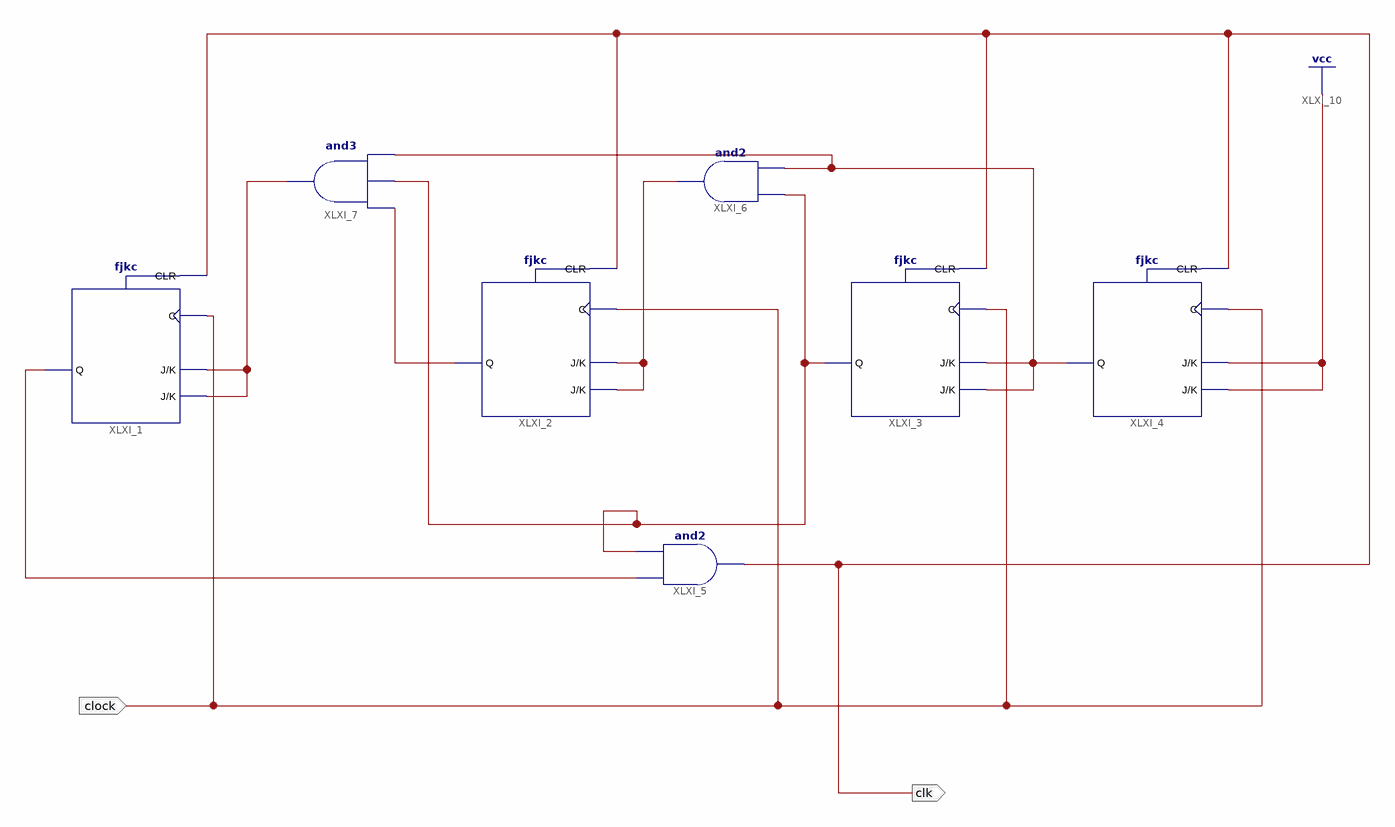
[diagram p0: schematic sheet 1]
// Xilinx ISE schematic mod10.sch (spartan6) as structural Verilog: 7 symbols, 2 ports
module mod10 (
  input  clock,
  output clk
);

  wire XLXN_4, XLXN_5, XLXN_6, XLXN_7, XLXN_9, XLXN_10;

  fjkc XLXI_1 (.C(clock), .CLR(clk), .J(XLXN_9), .K(XLXN_9), .Q(XLXN_10));
  fjkc XLXI_2 (.C(clock), .CLR(clk), .J(XLXN_6), .K(XLXN_6), .Q(XLXN_7));
  and XLXI_5 (clk, XLXN_10, XLXN_5);
  and XLXI_6 (XLXN_6, XLXN_4, XLXN_5);
  and XLXI_7 (XLXN_9, XLXN_7, XLXN_5, XLXN_4);
  fjkc XLXI_4 (.C(clock), .CLR(clk), .J(1'b1), .K(1'b1), .Q(XLXN_4));
  fjkc XLXI_3 (.C(clock), .CLR(clk), .J(XLXN_4), .K(XLXN_4), .Q(XLXN_5));
endmodule
